# Altium project sequencer.PrjPcb
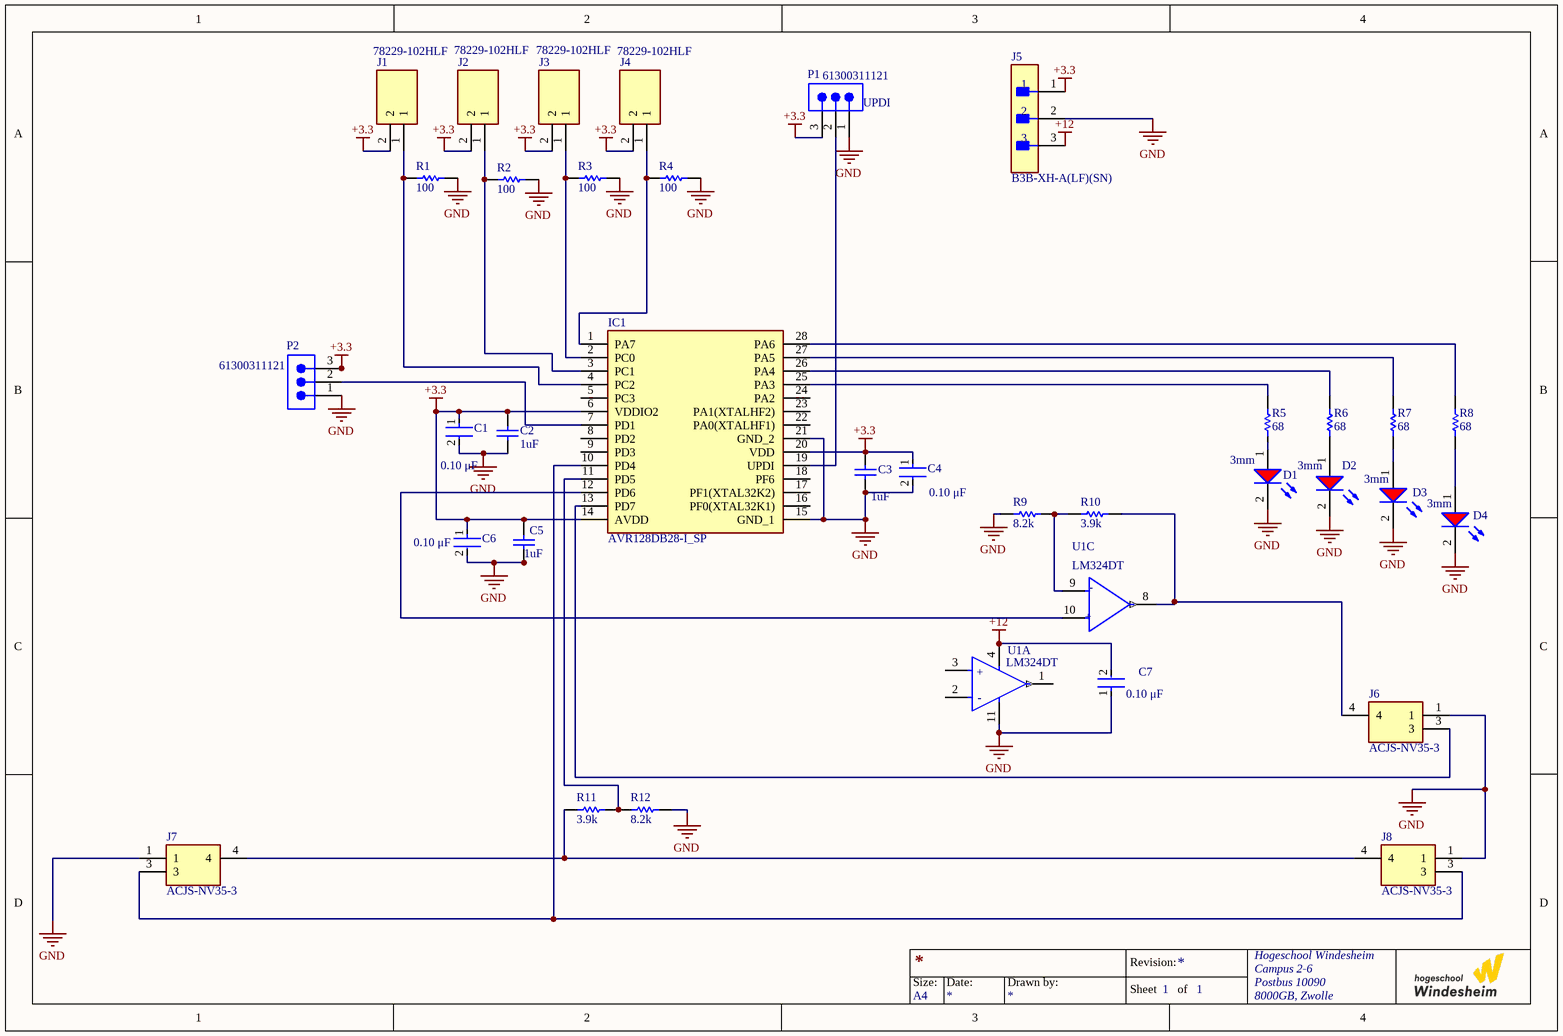
[diagram p0: sequencer final version.SchDoc]
1 sheet, 35 parts. Net scope: global (net labels, ports and power ports of the same name join across sheets).
Board file: sequencer pvb v2.PcbDoc

## Sheet sequencer final version.SchDoc
size A4; SheetNumber: 1; SheetTotal: 1

### Parts
C1  Capacitance: 0.10 μF  [FP-C1206C-EB-MFG]  (hidden comment: C1206C104K2RACTU)
C2  Capacitance: 1uF  [CAPC3216X110X50LL20T25]  (hidden comment: C1206C105K5RACTU)
C3  Capacitance: 1uF  [CAPC3216X110X50LL20T25]  (hidden comment: C1206C105K5RACTU)
C4  value 0.10 μF  [FP-C1206C-EB-MFG]  (hidden comment: C1206C104K2RACTU)
C5  Capacitance: 1uF  [CAPC3216X110X50LL20T25]  (hidden comment: C1206C105K5RACTU)
C6  value 0.10 μF  [FP-C1206C-EB-MFG]  (hidden comment: C1206C104K2RACTU)
C7  value 0.10 μF  [FP-C1206C-EB-MFG]  (hidden comment: C1206C104K2RACTU)
D1  Lens Size: 3mm  [WL-TMRC_D3.95H5.3]  (hidden comment: 151031SS04000)
D2  Lens Size: 3mm  [WL-TMRC_D3.95H5.3]  (hidden comment: 151031SS04000)
D3  Lens Size: 3mm  [WL-TMRC_D3.95H5.3]  (hidden comment: 151031SS04000)
D4  Lens Size: 3mm  [WL-TMRC_D3.95H5.3]  (hidden comment: 151031SS04000)
IC1  AVR128DB28-I_SP  [DIP794W56P254L3486H508Q28N]
J1  78229-102HLF  [HDRV2W67P0X254_1X2_508X241X1082P]
J2  78229-102HLF  [HDRV2W67P0X254_1X2_508X241X1082P]
J3  78229-102HLF  [HDRV2W67P0X254_1X2_508X241X1082P]
J4  78229-102HLF  [HDRV2W67P0X254_1X2_508X241X1082P]
J5  B3B-XH-A(LF)(SN)  [FP-B3B-XH-A_LF_SN-MFG]
J6  ACJS-NV35-3  [ACJSNV353]
J7  ACJS-NV35-3  [ACJSNV353]
J8  ACJS-NV35-3  [ACJSNV353]
P1  61300311121  [61300311121]
P2  61300311121  [61300311121]
R1  100  [RESC3216X70X50NL05T20]
R2  100  [RESC3216X70X50NL05T20]
R3  100  [RESC3216X70X50NL05T20]
R4  100  [RESC3216X70X50NL05T20]
R5  68  [RESC3216X60X45LL10T20]
R6  68  [RESC3216X60X45LL10T20]
R7  68  [RESC3216X60X45LL10T20]
R8  68  [RESC3216X60X45LL10T20]
R9  8.2k  [RESC3216X60X45NL10T20]
R10  3.9k  [RESC3216X70X50ML20T25]
R11  3.9k  [RESC3216X70X50ML20T25]
R12  8.2k  [RESC3216X60X45NL10T20]
U1  LM324DT  [FP-SO-14-MFG]  (parts A,C of 4)

### Nets
+3.3: C1.1 C2.2 C3.2 C4.1 C5.2 C6.1 IC1.6(VDDIO2) IC1.14(AVDD) IC1.20(VDD) J1.2 J2.2 J3.2 J4.2 J5.1 P1.3 P2.3
+12: C7.2 J5.3 U1.4(VCC+)
GND: C1.2 C2.1 C3.1 C4.2 C5.1 C6.2 C7.1 D1.2(K) D2.2(K) D3.2(K) D4.2(K) IC1.15(GND_1) IC1.21(GND_2) J5.2 J6.1 J7.1 J8.1 P1.1 P2.1 R1.2 R2.2 R3.2 R4.2 R9.1 R12.2 U1.11(VCC-)
NetD1_1: D1.1(A) R5.1
NetD2_1: D2.1(A) R6.1
NetD3_1: D3.1(A) R7.1
NetD4_1: D4.1(A) R8.1
NetIC1_1: IC1.1(PA7) J4.1 R4.1
NetIC1_2: IC1.2(PC0) J3.1 R3.1
NetIC1_3: IC1.3(PC1) J2.1 R2.1
NetIC1_4: IC1.4(PC2) J1.1 R1.1
NetIC1_7: IC1.7(PD1) P2.2
NetIC1_10: IC1.10(PD4) J7.3 J8.3
NetIC1_11: IC1.11(PD5) R11.2 R12.1
NetIC1_12: IC1.12(PD6) U1.10(Non-Inverting_Input_3)
NetIC1_13: IC1.13(PD7) J6.3
NetIC1_19: IC1.19(UPDI) P1.2
NetIC1_25: IC1.25(PA3) R5.2
NetIC1_26: IC1.26(PA4) R6.2
NetIC1_27: IC1.27(PA5) R7.2
NetIC1_28: IC1.28(PA6) R8.2
NetJ6_4: J6.4 R10.2 U1.8(Output_3)
NetJ7_4: J7.4 J8.4 R11.1
NetR9_2: R9.2 R10.1 U1.9(Inverting_Input_3)

Not connected (* = marked no-connect by the designer): IC1 5(PC3) 8(PD2) 9(PD3) 16(PF0(XTAL32K1)) 17(PF1(XTAL32K2)) 18(PF6) 22(PA0(XTALHF1)) 23(PA1(XTALHF2)) 24(PA2); U1 1(Output_1) 2(Inverting_Input_1) 3(Non-Inverting_Input_1)

### Notes on the sheet
- (near P1) UPDI
- Size:
- Date:
- Drawn by:
- Revision:
- Hogeschool Windesheim
- Campus 2-6
- Postbus 10090
- A4
- Sheet
- of
- 8000GB, Zwolle
- (in symbol CMP-12131-000005-1, part A) +; -
- (in symbol CMP-12131-000005-1, part C) -; +

### Library data of the parts
C1 = CMP-1037-04222-2: CAP CER 0.1UF 200V 10% X7R 1206; Manufacturer: KEMET; Automotive Grade: Grade 0; Tolerance: 0.1; Value: 0.10 μF; Material: Ceramic; Temperature Coefficient: 15%; Automotive: Yes; Temperature Characteristic: X7R; Digikey Description: CAP CER 0.1UF 200V 10% X7R 1206; ComponentLink2URL: https://content.kemet.com/datasheets/KEM_C1007_X8R_ULTRA_150C_SMD.pdf; Voltage Rating: 200 V; Manufacturer Part Number: C1206C104K2RACTU; Temperature Range High: +150°C; Device Class L1: Passive Components; Octopart: https://octopart.com/c1206c104k2ractu-kemet-9138344; Temperature: -55°C to +150°C; Height: 0.88mm; Device Class L3: Ceramic Capacitors; Lead Free: Yes; Package: C1206C-EB; Category: Cap; Temperature Range Low: -55°C; Mouser Description: Multilayer Ceramic Capacitors MLCC - SMD/SMT 200volts 0.1uF X7R 10%; Ipc Land Pattern Name: CAPC320160X78; RoHS: TRUE; ComponentLink2Description: Datasheet; Device Class L2: Capacitors
C2 C3 C5 = CMP-2000-06011-1: Chip Capacitor, 1 uF, +/- 10%, 50 V, -55 to 125 degC, 1206 (3216 Metric), RoHS, Tape and Reel; Manufacturer: Kemet; Case Height: 1mm; Dielectric: X7R; Voltage Rating: 50V; Temperature Coefficient / Code: +/-15%; Case Length: 3.2mm; Case Width: 1.6mm; Type: SMDMLCCX7R6.3-250VDCCommericalGrade; Class: Class1; Capacitance - nF: 1000nF; Datasheet URL: http://www.kemet.com/docfinder?Partnumber=C1206C105K5RACTU; Product Category: MultilayerCeramicCapacitorsMLCC-SMD/SMT; Termination Style: SMD/SMT; Dimensions: 1.6mmWx3.2mmLx1mmH; Voltage Rating DC: 50V; Datasheet Version: 02/2016; Packaging: Reel; Brand: Kemet; RoHS: Details; Minimum Operating Temperature: -55C; Operating Temperature Range: -55Cto+125C; Package Reference: 1206; Manufacturer URL: http://www.kemet.com/; Product: GeneralTypeMLCCs; Tolerance: 10%; Package Description: 2-Pin Surface Mount Device, Body 3.2 x 1.6 mm; Mounting Technology: SurfaceMount; Case Code - mm: 3216; Maximum Operating Temperature: +125C; Series: C1206C; Factory Pack Quantity: 2500; Package / Case: 1206(3216metric); Case Code - in: 1206
C4 C6 C7 = CMP-1037-04222-2: CAP CER 0.1UF 200V 10% X7R 1206; Manufacturer: KEMET; Automotive Grade: Grade 0; Tolerance: 0.1; Material: Ceramic; Temperature Coefficient: 15%; Automotive: Yes; Temperature Characteristic: X7R; Digikey Description: CAP CER 0.1UF 200V 10% X7R 1206; ComponentLink2URL: https://content.kemet.com/datasheets/KEM_C1007_X8R_ULTRA_150C_SMD.pdf; Voltage Rating: 200 V; Manufacturer Part Number: C1206C104K2RACTU; Temperature Range High: +150°C; Device Class L1: Passive Components; Octopart: https://octopart.com/c1206c104k2ractu-kemet-9138344; Temperature: -55°C to +150°C; Height: 0.88mm; Device Class L3: Ceramic Capacitors; Lead Free: Yes; Package: C1206C-EB; Category: Cap; Temperature Range Low: -55°C; Mouser Description: Multilayer Ceramic Capacitors MLCC - SMD/SMT 200volts 0.1uF X7R 10%; Ipc Land Pattern Name: CAPC320160X78; Capacitance: 0.10 μF; RoHS: TRUE; ComponentLink2Description: Datasheet; Device Class L2: Capacitors
D1-D4 = CMP-1488-00005-2: NexarPartId: 29717802; Wavelength: 635nm; Luminous Intensity: 160mcd; Peak Wavelength: 640nm; Forward Voltage: 2V; Color: Red; Max Reverse Voltage (DC): 5V; Viewing Angle: 40°; Forward Current: 100mA; Lens Style: Circular, Diffused, Round; Test Current: 20mA; Packaging: Bulk; RoHS: Compliant; Height: 5.3mm; Mount: Through Hole; Max Operating Temperature: 85°C; Length: 3mm; Dominant Wavelength: 635nm; REACH SVHC: Unknown; Case/Package: Radial; Min Operating Temperature: -40°C; Width: 3mm
IC1 = AVR128DB28-I_SP: Integrated Circuit; Manufacturer_Name: Microchip; Manufacturer_Part_Number: AVR128DB28-I/SP; Datasheet Link: https://ww1.microchip.com/downloads/en/DeviceDoc/AVR128DB28-32-48-64-DataSheet-DS40002247A.pdf; Height: 5.08mm; Mouser Part Number: 579-AVR128DB28-I/SP; Mouser Price/Stock: https://www.mouser.co.uk/ProductDetail/Microchip-Technology/AVR128DB28-I-SP?qs=vmHwEFxEFR9SktvWL9jpqg%3D%3D; Arrow Part Number: AVR128DB28-I/SP; Arrow Price/Stock: https://www.arrow.com/en/products/avr128db28-isp/microchip-technology?region=nac
J1-J4 = 78229-102HLF: Connector; Manufacturer_Name: Amphenol; Datasheet Link: https://cdn.amphenol-icc.com/media/wysiwyg/files/drawing/69190.pdf; Height: 10.82mm; Manufacturer_Part_Number: 78229-102HLF; Arrow Part Number: 78229-102HLF; Arrow Price/Stock: https://www.arrow.com/en/products/78229-102hlf/amphenol-fci?region=europe
J5 = CMP-17439-000014-3: CONN HEADER VERT 3POS 2.5MM; Max Voltage Rating (DC): 250V; Number of Positions: 3; Current Rating: 3A; Gender: Male; Wire/Cable Gauge: 22AWG; Contact Resistance: 20mR; Insulation Resistance: 1GR; Insulation Material: Nylon; Contact Plating: Tin; Depth: 5.75mm; Contact Type: Male Pin; Max Operating Temperature: 85°C; Insulation Color: Natural; Voltage Rating (AC): 250V; Color: Natural; Connector Type: Header; Orientation: Straight; Fastening Type: Detent; Housing Color: White; Min Operating Temperature: -25°C; Termination: Solder; Voltage Rating: 250V; Series: XH; Pitch: 2.5mm; Contact Shape: Square; Number of Rows: 1; Lead Free: Lead Free; Packaging: Bulk; Mount: Through Hole; Flammability Rating: UL94 V-0; Max Voltage Rating (AC): 250V; REACH SVHC: No SVHC; Housing Material: Polyamide; Contact Material: Brass; Lead Pitch: 2.5mm; Contact Finish - Mating: TIN; Length: 9.9mm; Max Current Rating: 3A; Number of Contacts: 3
J6-J8 = ACJS-NV35-3: Connector; Manufacturer_Name: Amphenol; Datasheet Link: https://www.amphenolaudio.com/wp-content/uploads/2015/07/55010544000110_acjx-nv35-x.pdf; Height: 27mm; Manufacturer_Part_Number: ACJS-NV35-3; Mouser Part Number: 523-ACJS-NV35-3; Mouser Price/Stock: https://www.mouser.co.uk/ProductDetail/Amphenol-Audio/ACJS-NV35-3?qs=t8VhaDIDl4uNwZ56Tr4iPg%3D%3D; Arrow Part Number: ACJS-NV35-3; Arrow Price/Stock: https://www.arrow.com/en/products/acjs-nv35-3/amphenol-sine-systems
P1 P2 = CMP-1502-01062-3: Potmeter connectie; NexarPartId: 32855521; Current Rating: 3A; Voltage Rating: 250V; Number of Positions: 3; Pitch: 2.54mm; Contact Resistance: 20mΩ; Connector Type: Male Pin; Gender: Male; REACH SVHC: Unknown; Packaging: Bulk; Contact Material: Copper; Min Operating Temperature: -40°C; Number of Rows: 1; Orientation: Vertical; RoHS: Compliant; Contact Plating: Gold; Max Operating Temperature: 105°C; Mount: Through Hole; Height: 8.94mm; Operating Supply Voltage: 250V; Number of Pins: 3; Contact Mating Length: 5.9944mm; Number of Contacts: 3; Color: Black; Lead Free: Lead Free; Lead Pitch: 2.54mm; Termination: Solder
R1-R4 = CMP-2003-00016-1: Manufacturer: Panasonic; Part Number: ERJ-8ENF1000V
R5-R8 = CMP-1014-00378-2: Manufacturer: Vishay Dale; Part Number: CRCW120668R0FKEA
R9 R12 = CMP-2003-02160-1: Manufacturer: Vishay Dale; Part Number: CRCW12063K90FKEA
R10 R11 = CMP-2003-04435-1: Part Number: ERA8AEB202V; Manufacturer: Panasonic
U1 = CMP-12131-000005-1: IC OPAMP GP 4 CIRCUIT 14SO; Manufacturer: STMicroelectronics; Voltage Gain: 100dB; Standoff Height: 0.1mm; Bandwidth: 1.3MHz; Max Junction Temp: +150°C; Min Supply Voltage: 3V; Max Dual Supply Voltage: 15V; Min Dual Supply Voltage: 1.5V; Number Of Channels: 4; Nominal Supply Current: 0.7-1.5mA; Output Current Per Channel: 20-50mA; Max Supply Voltage: 30V; Input Offset Voltage: 2mV; Input Bias Current: 0.02uA; Device Class L1: Integrated Circuits (ICs); Device Class L3: Amplifiers - Op Amps; Temperature Range Low: 0°C; Package: SO-14; Temperature Range High: +70°C; Digikey Description: IC OPAMP GP 4 CIRCUIT 14SO; Device Class L2: Linear ICs; Footprint Url: https://www.st.com/content/ccc/resource/technical/document/datasheet/group3/10/8a/e6/12/f8/e8/49/ce/DM00366438/files/DM00366438.pdf/jcr:content/translations/en.DM00366438.pdf; Octopart: https://octopart.com/lm324dt-stmicroelectronics-39579146; ComponentLink2URL: https://www.st.com/content/ccc/resource/technical/document/datasheet/bd/fc/46/43/26/8f/40/7f/CD00001046.pdf/files/CD00001046.pdf/jcr:content/translations/en.CD00001046.pdf; ComponentLink2Description: Datasheet; Lead Free: Yes; Temperature: 0°C to +70°C; RoHS: TRUE; Gain Bandwidth: 1.3MHz; Manufacturer Part Number: LM324DT; Automotive: No; Category: IC; Height: 1.75mm; Mouser Description: LM324 Series 32 V 1.3 MHz Low Power Quad Operational Amplifier - SOIC-14